# EAGLE design 04151_lcdi2c (EAGLE 5.03)
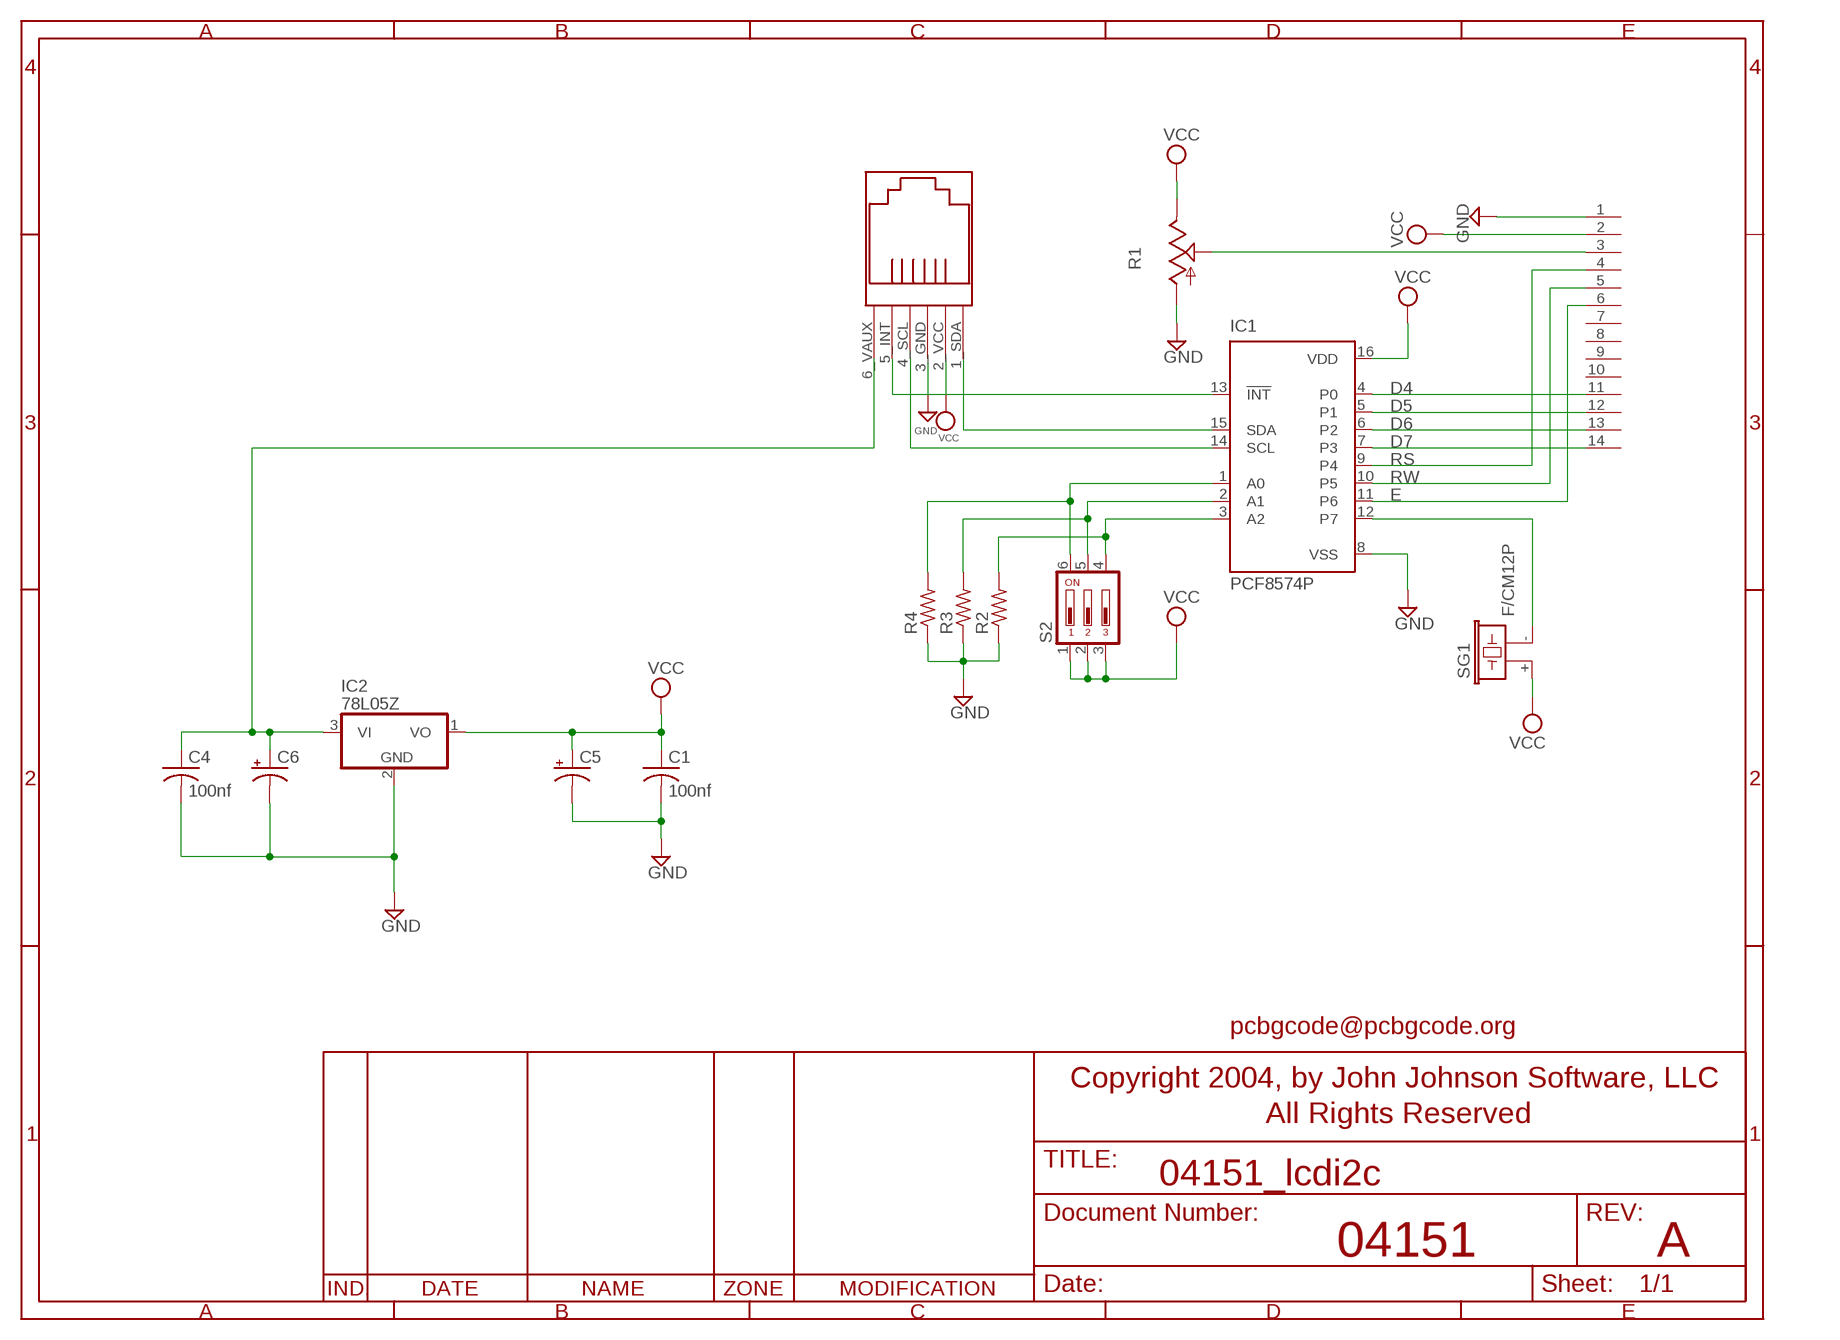
[diagram p0: schematic, sheet 1]

## Parts
C1  100nf  C-US025-025X050  [C025-025X050]
C4  100nf  C-US025-025X050  [C025-025X050]
C5  CPOL-US!FAT_E2,5-5  [!FAT_E2,5-5]
C6  CPOL-US!FAT_E2,5-5  [!FAT_E2,5-5]
IC1  PCF8574P  [DIL16]
IC2  78L05Z  [TO92]
R1  TRIM_US-PT-SPIN  [PT-SPIN]
R2  R-US_0204/5  [0204/5]
R3  R-US_0204/5  [0204/5]
R4  R-US_0204/5  [0204/5]
S2  DIP03YL  [DIP03YL]
SG1  F/CM12P  [F/CM12P]
U$1  RJ-12  [RJ-12]
U$2  MA07-2-SGL  [MA07-2]

## Nets
D4: IC1.4(P0) U$2.11
D5: IC1.5(P1) U$2.12
D6: IC1.6(P2) U$2.13
D7: IC1.7(P3) U$2.14
E: IC1.11(P6) U$2.6
GND: C1.2 C4.2 C5.P$2(-) C6.P$2(-) IC1.8(VSS) IC2.2(GND) R1.A R2.1 R3.1 R4.1 U$1.3_GND U$2.1
N$1: R1.S U$2.3
N$2: IC1.3(A2) R2.2 S2.4
N$3: IC1.2(A1) R3.2 S2.5
N$4: IC1.1(A0) R4.2 S2.6
N$5: IC1.13(!INT) U$1.5_INT
N$7: IC1.15(SDA) U$1.1_SDA
N$8: IC1.12(P7) SG1.-
N$9: IC1.14(SCL) U$1.4_SCL
N$12: C4.1 C6.P$1(+) IC2.3(VI) U$1.6_VAUX
RS: IC1.9(P4) U$2.4
RW: IC1.10(P5) U$2.5
VCC: C1.1 C5.P$1(+) IC1.16(VDD) IC2.1(VO) R1.E S2.1 S2.2 S2.3 SG1.+ U$1.2_VCC U$2.2
Unconnected: U$2.7 U$2.8 U$2.9 U$2.10

## Notes on the sheet
- pcbgcode@pcbgcode.org
- 04151 | A

## Library data of the parts
C1 C4 = rcl:C-US: CAPACITOR, American symbol
C5 C6 = rcl:CPOL-US: POLARIZED CAPACITOR, American symbol
IC1 = micro-philips:PCF8574: I2C-Bus I/O DEVICE
IC2 = linear:78*: Positive VOLTAGE REGULATOR
R1 = pot:TRIM_US-: POTENTIOMETER
R2-R4 = rcl:R-US_: RESISTOR, American symbol
S2 = switch-dil:DIP03YL: DIL/CODE SWITCH
SG1 = buzzer:F/CM12P: BUZZER Source: Buerklin
U$1 = con-rj:RJ-12
U$2 = con-lstb:MA07-2-SGL

## Net classes
0 default: width 0.406 mm

## Board
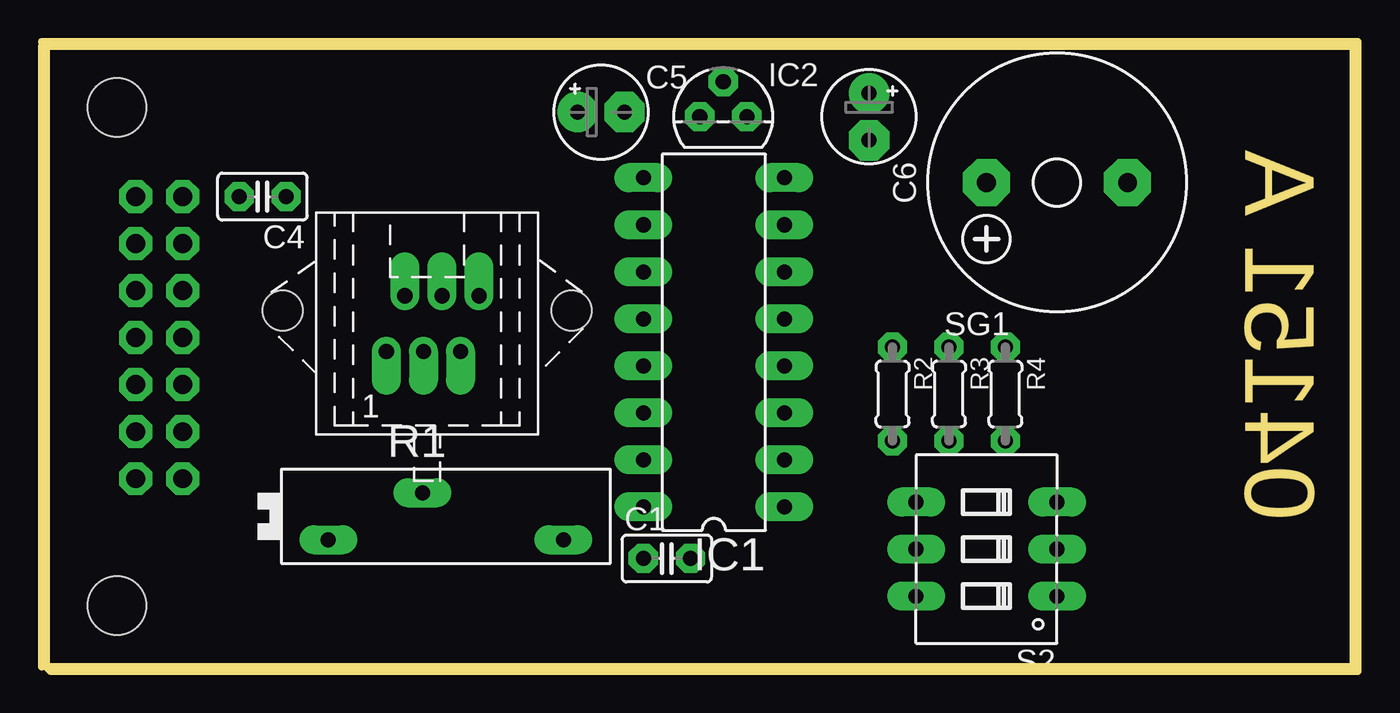
[diagram p1: board, top side]
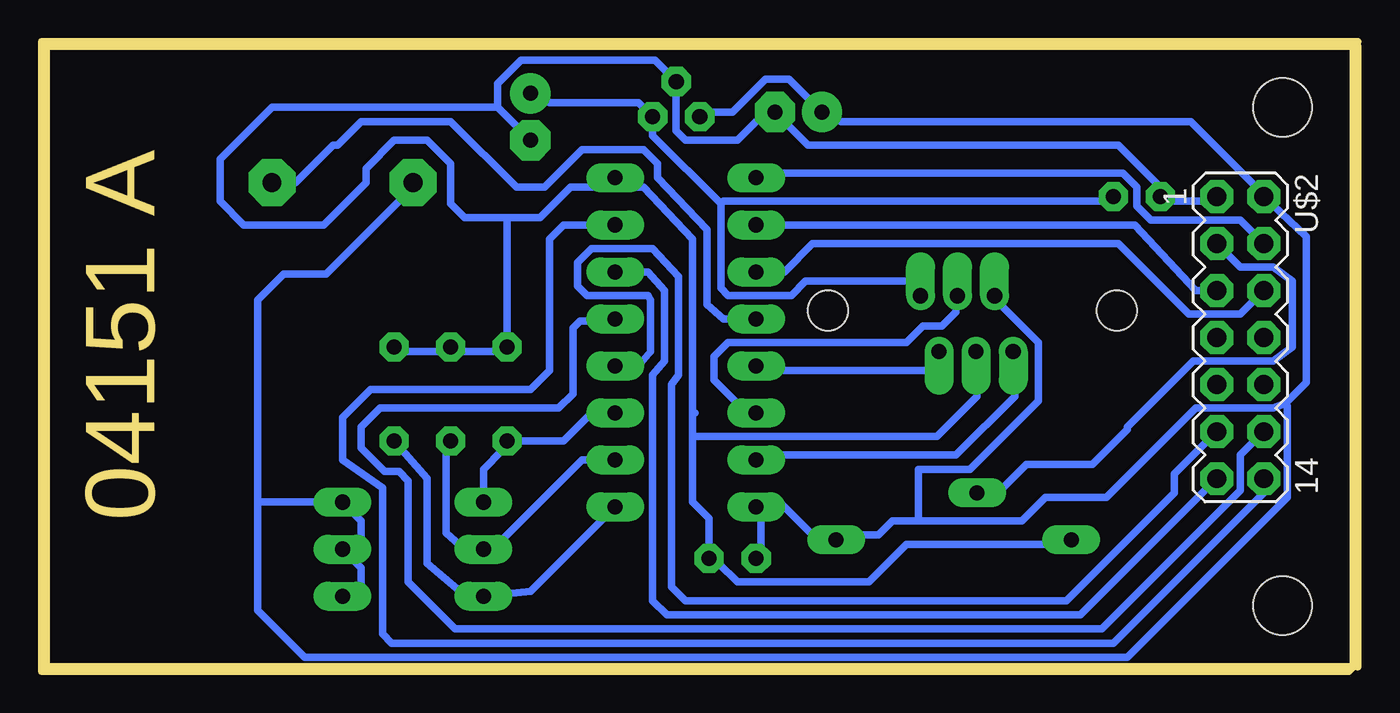
[diagram p2: board, bottom side, seen from below]

Size 70.61 x 33.53 mm. Coordinates in mm from the lower left corner, seen from the top.
Outline: 0,0 70.61,0 70.61,33.53 0,33.53 0,0
Copper layers (1*16): Top 0.035mm / dielectric 1.5mm / Bottom 0.035mm
Design rules "default": minimum track width 16mil, minimum drill 24mil, track to track 10mil, track to pad 5mil, pad to pad 10mil, via to via 10mil, smd to smd 10mil, copper to edge 0mil, drill to drill 8mil, minimum pad ring 10mil, minimum via ring 30mil, stop-mask expansion 4mil, vias tented up to drill 0mil, thermal gap 16mil
Holes 3.17 mm at 3.81,30.23 3.81,3.3
Milling: 5 lines

### Footprints (pad centres in the part's own frame; a part is rotated, then mirrored left to right if it is on the bottom)
C025-025X050 = drill 0.813 octagon: 1 -1.27,0; 2 1.27,0
!FAT_E2,5-5 = drill 0.813 pad 2.184 round: P$1 -1.27,0 | drill 0.813 pad 2.184 octagon: P$2 1.27,0
DIL16 = drill 0.813 long: 1 -8.89,-3.81; 2 -6.35,-3.81; 3 -3.81,-3.81; 4 -1.27,-3.81; 5 1.27,-3.81; 6 3.81,-3.81; 7 6.35,-3.81; 8 8.89,-3.81; 9 8.89,3.81; 10 6.35,3.81; 11 3.81,3.81; 12 1.27,3.81; 13 -1.27,3.81; 14 -3.81,3.81; 15 -6.35,3.81; 16 -8.89,3.81
TO92 = drill 0.813 octagon: 1 -1.27,0; 2 0,1.905; 3 1.27,0
PT-SPIN = drill 0.813 long: A -6.35,-1.27; E 6.35,-1.27; S -1.27,1.27
0204/5 = drill 0.813 octagon: 1 -2.54,0; 2 2.54,0
DIP03YL = drill 0.813 long: 1 -2.54,-3.81; 2 0,-3.81; 3 2.54,-3.81; 4 2.54,3.81; 5 0,3.81; 6 -2.54,3.81
F/CM12P = drill 1.016 pad 2.54 octagon: + 3.81,0; - -3.81,0
RJ-12 = drill 0.813 offset: 1_SDA 2.2,1.5; 2_VCC 1.2,-1.5; 3_GND 0.2,1.5; 4_SCL -0.8,-1.5; 5_INT -1.8,1.5; 6_VAUX -2.8,-1.5 | hole 2.184: -7.8,-0.7; 7.8,-0.7
MA07-2 = drill 1.016 octagon: 1 -7.62,-1.27; 2 -7.62,1.27; 3 -5.08,-1.27; 4 -5.08,1.27; 5 -2.54,-1.27; 6 -2.54,1.27; 7 0,-1.27; 8 0,1.27; 9 2.54,-1.27; 10 2.54,1.27; 11 5.08,-1.27; 12 5.08,1.27; 13 7.62,-1.27; 14 7.62,1.27

### Placement (x,y rotation side)
C1  33.53,5.84 0 top
C4  11.68,25.4 180 top
C5  29.97,29.97 0 top
C6  44.45,29.72 270 top
IC1  36.07,17.53 90 top
IC2  36.58,29.72 0 top
R1  21.59,8.13 0 top
R2  45.72,14.73 270 top
R3  48.77,14.73 270 top
R4  51.82,14.73 270 top
S2  50.8,6.35 90 top
SG1  54.61,26.16 180 top
U$1  20.57,18.54 180 top
U$2  6.1,17.78 270 bottom

### Tracks (layer width: path | path; a pad name or v marks a point on that pad's centre or on a via)
D4
  Bottom 0.406: IC1.4 38.61,16.26 37.97,17.02 37.97,19.81 38.1,20.07 41.4,20.07 41.91,20.57 41.91,21.84 41.15,22.61 37.85,22.61 36.45,21.08 36.45,15.75 36.83,15.24 36.83,4.32 36.07,3.56 15.49,3.56 9.65,9.4 9.65,10.41 U$2.11
D5
  Bottom 0.406: U$2.12 6.1,11.43 6.1,9.53 13.59,2.03 48.51,2.03 51.05,4.57 51.05,10.03 51.56,10.54 52.32,10.54 53.59,11.81 53.59,12.95 52.58,13.97 42.93,13.97 42.16,14.73 42.16,18.29 41.78,18.67 41.15,18.67 41.08,18.61 | IC1.5 40.89,18.8 41.08,18.61 | 41.08,18.61 41.15,18.54
D6
  Bottom 0.406: U$2.13 14.73,2.79 37.08,2.79 37.85,3.56 37.85,15.75 37.21,16.51 37.21,20.32 38.1,21.34 IC1.6
D7
  Bottom 0.406: U$2.14 4.83,9.4 12.95,1.27 51.94,1.27 52.45,1.78 52.45,9.65 54.61,11.18 54.61,13.46 53.09,14.99 44.45,14.99 43.43,16 43.43,23.11 42.67,23.88 IC1.7
E
  Bottom 0.406: U$2.6 6.1,19.05 8.89,19.05 12.7,22.86 29.21,22.86 30.73,21.34 IC1.11 32.38,21.34
GND
  Bottom 0.406: R1.A 16.51,6.6 24.13,6.6 26.16,4.57 33.27,4.57 34.29,5.59 C1.2 34.8,8 35.69,8.89 35.69,12.45 | R4.1 51.31,17.02 49.28,17.02 R3.1 48.26,17.02 46.23,17.02 R2.1 45.72,24.26 | U$2.1 7.87,25.15 9.91,25.15 C4.2 10.41,25.91 12.7,28.19 29.46,28.19 C5.P$2 32.26,29.46 33.27,28.45 36.07,28.45 36.58,28.96 IC2.2 37.72,32.77 44.96,32.77 46.23,31.5 46.23,30.23 | 46.23,30.23 C6.P$2 | 46.23,30.23 58.42,30.23 61.21,27.43 61.21,25.15 59.94,23.88 55.63,23.88 53.34,26.16 53.34,26.92 51.82,28.45 50.04,28.45 48.77,27.18 48.77,25.02 48.01,24.26 45.72,24.26 | U$1.3_GND 20.34,17.04 20.32,17.02 20.32,14.61 22.48,12.45 35.69,12.45 | 35.69,12.45 35.69,13.59 35.56,13.72 35.69,13.72 35.69,23.11 38.35,25.91 39.37,25.91 IC1.8 40.39,25.91 42.29,25.91 43.94,24.26 45.72,24.26
N$1
  Bottom 0.406: R1.S 19.05,9.65 18.92,9.65 17.65,10.92 14.1,10.92 12.19,12.83 12.19,12.95 8.64,16.51 4.32,16.51 3.3,17.27 3.3,20.83 4.32,21.59 6.1,21.59 U$2.3
N$2
  Bottom 0.406: 45.77,12.09 45.97,11.68 46.99,10.67 S2.4 | 45.77,12.09 R2.2 | IC1.3 41.15,13.72 42.67,12.19 45.97,12.19 45.87,12.09 45.77,12.09
N$3
  Bottom 0.406: IC1.2 41.66,11.18 46.23,6.6 S2.5 48.01,6.35 49.02,7.24 49.02,12.19 R3.2
N$4
  Bottom 0.406: S2.6 47.24,4.06 | IC1.1 44.45,4.06 S2.6 | S2.6 48.26,4.06 50.04,5.59 50.04,10.16 R4.2
N$5
  Bottom 0.406: IC1.13 30.99,16 22.86,16 U$1.5_INT
N$7
  Bottom 0.406: IC1.15 30.99,11.43 21.46,11.43 18.29,14.61 18.29,17.02 18.31,17.04 U$1.1_SDA
N$8
  Bottom 0.406: IC1.12 34.04,18.8 34.92,19.56 34.92,23.62 37.59,26.42 37.59,27.18 38.35,27.94 41.66,27.94 43.69,25.91 45.21,25.91 48.77,29.46 53.59,29.46 54.86,28.19 55.12,28.19 57.15,26.16 SG1.-
N$9
  Bottom 0.406: IC1.14 32.77,13.72 34.54,15.49 34.54,16.76 33.78,17.53 24.13,17.53 23.24,18.41 22.23,18.41 21.46,19.18 21.46,19.94 21.37,20.03 U$1.4_SCL
N$12
  Bottom 0.406: 23.88,20.83 U$1.6_VAUX | C4.1 13.46,25.15 34.04,25.15 34.16,25.02 | C6.P$1 43.43,30.48 38.61,30.48 IC2.3 37.85,28.7 34.16,25.02 | 34.16,25.02 34.16,20.45 33.78,20.07 30.35,20.07 29.59,20.83 23.88,20.83 | 23.88,20.83 23.75,20.95
RS
  Bottom 0.406: IC1.9 30.99,26.67 12.45,26.67 11.68,25.91 11.68,24.89 10.92,24.13 6.1,24.13 U$2.4
RW
  Bottom 0.406: IC1.10 11.81,23.88 8.51,20.32 U$2.5
VCC
  Bottom 0.406: S2.1 53.59,3.81 53.59,5.33 S2.2 53.59,6.35 53.59,7.87 S2.3 59.18,8.89 | SG1.+ 51.56,25.15 55.5,21.21 57.78,21.21 59.18,19.81 59.18,8.89 | U$1.2_VCC 19.05,19.56 17.02,17.53 17.02,14.35 20.7,10.67 23.5,10.67 23.5,8 23.62,7.87 | C1.1 32,6.35 32,8.13 IC1.16 30.99,8.89 29.21,7.11 R1.E 26.67,7.11 25.65,7.11 24.89,7.87 23.62,7.87 | 3.68,14.22 2.54,15.37 2.54,23.24 U$2.2 5.33,25.91 5.33,26.04 8.76,29.46 27.69,29.46 C5.P$1 30.48,31.75 31.75,31.75 33.53,29.97 35.05,29.97 IC2.1 | 3.68,14.22 4.32,13.97 8.51,13.97 13.34,9.14 16.64,9.14 17.91,7.87 23.62,7.87 | 3.68,14.22 3.56,14.1 3.56,9.14 12.19,0.51 56.64,0.51 59.18,3.05 59.18,8.89

### Text on the board
Milling: 04151 A